# Altium schematic sheet IMX_1.2V Digital Power Supply.SchDoc
size A4; SheetNumber: 3; SheetTotal: 8
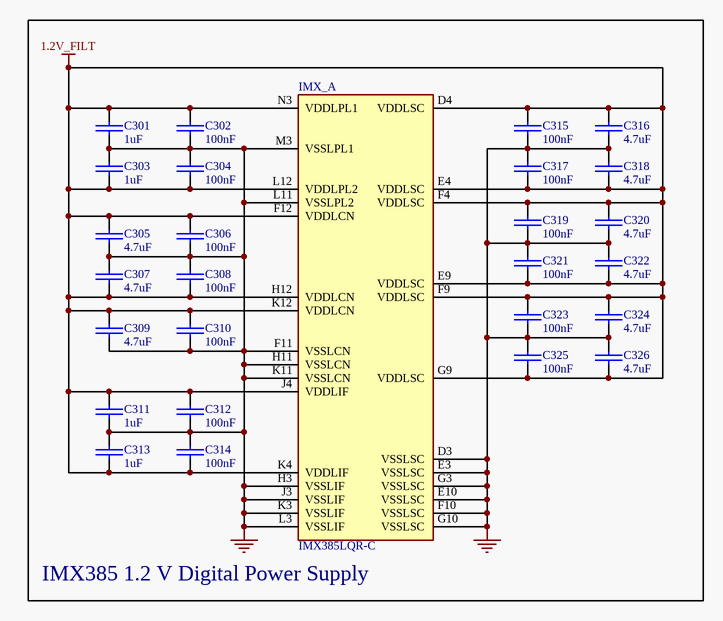
[diagram p0: IMX_1.2V Digital Power Supply.SchDoc]

## Parts
C301  1uF  [Capacitor, 0402]
C302  100nF  [Capacitor, 0402]
C303  1uF  [Capacitor, 0402]
C304  100nF  [Capacitor, 0402]
C305  4.7uF  [Capacitor, 0402]
C306  100nF  [Capacitor, 0402]
C307  4.7uF  [Capacitor, 0402]
C308  100nF  [Capacitor, 0402]
C309  4.7uF  [Capacitor, 0402]
C310  100nF  [Capacitor, 0402]
C311  1uF  [Capacitor, 0402]
C312  100nF  [Capacitor, 0402]
C313  1uF  [Capacitor, 0402]
C314  100nF  [Capacitor, 0402]
C315  100nF  [Capacitor, 0402]
C316  4.7uF  [Capacitor, 0402]
C317  100nF  [Capacitor, 0402]
C318  4.7uF  [Capacitor, 0402]
C319  100nF  [Capacitor, 0402]
C320  4.7uF  [Capacitor, 0402]
C321  100nF  [Capacitor, 0402]
C322  4.7uF  [Capacitor, 0402]
C323  100nF  [Capacitor, 0402]
C324  4.7uF  [Capacitor, 0402]
C325  100nF  [Capacitor, 0402]
C326  4.7uF  [Capacitor, 0402]
IMX_  IMX385LQR-C  [IMX385LQR]  (part A of 6)

## Blocks framed on the sheet
IMX385 1.2 V Digital Power Supply: C301-C326 IMX_

## Nets
1.2V_FILT: C301.1 C302.1 C303.2 C304.2 C305.1 C306.1 C307.2 C308.2 C309.1 C310.1 C311.1 C312.1 C313.2 C314.2 C315.1 C316.1 C317.2 C318.2 C319.1 C320.1 C321.2 C322.2 C323.1 C324.1 C325.2 C326.2 IMX_.D4(VDDLSC) IMX_.E4(VDDLSC) IMX_.E9(VDDLSC) IMX_.F4(VDDLSC) IMX_.F9(VDDLSC) IMX_.F12(VDDLCN) IMX_.G9(VDDLSC) IMX_.H12(VDDLCN) IMX_.J4(VDDLIF) IMX_.K4(VDDLIF) IMX_.K12(VDDLCN) IMX_.L12(VDDLPL2) IMX_.N3(VDDLPL1)
GND: C301.2 C302.2 C303.1 C304.1 C305.2 C306.2 C307.1 C308.1 C309.2 C310.2 C311.2 C312.2 C313.1 C314.1 C315.2 C316.2 C317.1 C318.1 C319.2 C320.2 C321.1 C322.1 C323.2 C324.2 C325.1 C326.1 IMX_.D3(VSSLSC) IMX_.E3(VSSLSC) IMX_.E10(VSSLSC) IMX_.F10(VSSLSC) IMX_.F11(VSSLCN) IMX_.G3(VSSLSC) IMX_.G10(VSSLSC) IMX_.H3(VSSLIF) IMX_.H11(VSSLCN) IMX_.J3(VSSLIF) IMX_.K3(VSSLIF) IMX_.K11(VSSLCN) IMX_.L3(VSSLIF) IMX_.L11(VSSLPL2) IMX_.M3(VSSLPL1)

## Library data of the parts
C301 C303 C311 C313 = Capacitor, 0402, 1uF: Ceramic Capacitor, 10V, 10% +/- Tol, X7R, 1uF, SMD, 0402, #GRM155Z71A105KE01D, JLC#C528974; Capacitance: 1uF
C302 C304 C306 C308 C310 C312 C314 C315 C317 C319 C321 C323 C325 = Capacitor, 0402, 100nF: Ceramic Capacitor, 16V, 10% +/- Tol, X7R, 0.1uF, SMD, 0402, #CL05B104KO5NNNC, JLC#C1525; Capacitance: 100nF
C305 C307 C309 C316 C318 C320 C322 C324 C326 = Capacitor, 0402, 4.7uF: Ceramic Capacitor, 10V, 10% +/- Tol, X5R, 4.7uF, SMD, 0402, #CL05A475KP5NRNC, JLC#C368809; Capacitance: 4.7uF
IMX_ = IMX385LQR